# Altium schematic sheet pca20053_sheet3_nRF21540_FEM.SchDoc: Thingy:53 nRF21540 Front-end module
size A3; Organization: Nordic Semiconductor; DocumentNumber: 3; SheetNumber: 3; SheetTotal: 6; CompanyName: Nordic Semiconductor; DocumentSize: A3
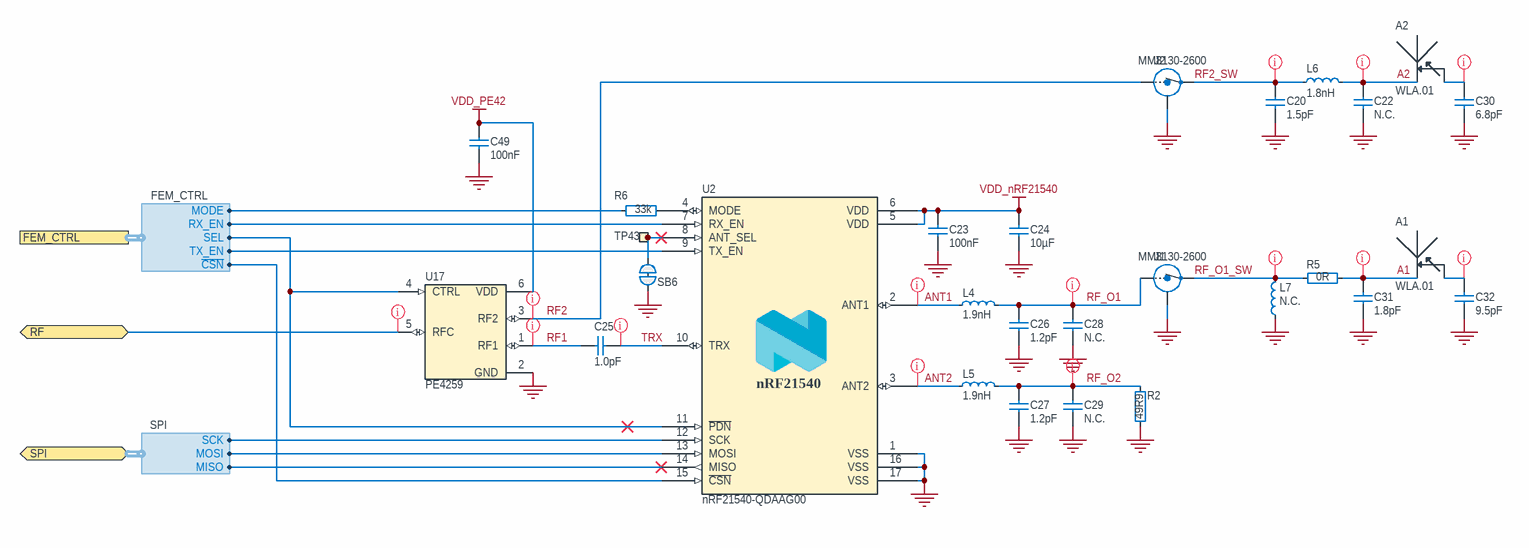
[diagram p0: pca20053_sheet3_nRF21540_FEM.SchDoc]

## Parts
A1  WLA.01  [WLA.01]
A2  WLA.01  [WLA.01]
C20  1.5pF  [CAPC0603X03L_C]
C22  N.C.  [CAPC0603X03L_C_NC]
C23  100nF  [CAPC0603X03L_C]
C24  10µF  [CAPC1608X06L]
C25  1.0pF  [CAPC0603X03L_C]
C26  1.2pF  [CAPC0603X03L_C]
C27  1.2pF  [CAPC0603X03L_C]
C28  N.C.  [CAPC0603X03L_C_NC]
C29  N.C.  [CAPC0603X03L_C_NC]
C30  6.8pF  [CAPC0603X03L_C]
C31  1.8pF  [CAPC0603X03L_C]
C32  9.5pF  [CAPC0603X03L_C]
C49  100nF  [CAPC0603X03L_C]
J1  MM8130-2600  [COAXIAL-SWF]
J2  MM8130-2600  [COAXIAL-SWF]
L4  1.9nH  [INDC0603X03L_C]
L5  1.9nH  [INDC0603X03L_C]
L6  1.8nH  [INDC0603X03L_C]
L7  N.C.  [INDC0603X03L_C_NC]
R2  49R9  [RESC1005X04L]
R5  0R  [RESC0603X03L_C]
R6  33k  [RESC0603X03L_C]
SB6  Solderbridge  [Solderbridge_Shorted]  (value not drawn)  (net tie, no BOM)
TP43  Ø1.5mm,SMD  [TP_SMD_D1.5mm]  (value not drawn)  (no BOM)
U2  nRF21540-QDAAG00  [QFN65P400X400X65_HS-17N]
U17  PE4259  [SOT65P210X100-6N]

## Ports
FEM_CTRL (harness FEM_CTRL), RF (bidir), SPI (bidir, harness SPI)

## Harnesses
SPI: MISO, MOSI, SCK
FEM_CTRL: MODE, RX_EN, SEL, TX_EN, ~{CSN}

## Nets
GND: A1.2(GND) A2.2(GND) C20.1 C22.1 C23.1 C24.1 C26.1 C27.1 C28.1 C29.1 C30.2 C31.1 C32.2 C49.1 J1.2(Shield) J2.2(Shield) L7.1 R2.1 SB6.2 U2.1(VSS) U2.16(VSS) U2.17(VSS) U17.2(GND)
VDD_nRF21540: C23.2 C24.2 U2.5(VDD) U2.6(VDD)
VDD_PE42: C49.2 U17.6(VDD)
A1: A1.1 C31.2 R5.2
A2: A2.1 C22.2 L6.2
ANT1: L4.1 U2.2(ANT1)
ANT2: L5.1 U2.3(ANT2)
RF: U17.5(RFC) ; port RF
RF1: C25.1 U17.1(RF1)
RF2: J2.1(IN) U17.3(RF2)
RF2_SW: C20.2 J2.3(OUT) L6.1
RF_O1: C26.2 C28.2 J1.1(IN) L4.2
RF_O1_SW: J1.3(OUT) L7.2 R5.1
RF_O2: C27.2 C29.2 L5.2 R2.2
TRX: C25.2 U2.10(TRX)
NetA1_3: A1.3(Tuning) C32.1
NetA2_3: A2.3(Tuning) C30.1
NetR6_1: R6.1 ; port FEM_CTRL.MODE
NetR6_2: R6.2 U2.4(MODE)
NetSB6_1: SB6.1 TP43.1 U2.8(ANT_SEL)
NetU2_7: U2.7(RX_EN) ; port FEM_CTRL.RX_EN
NetU2_9: U2.9(TX_EN) ; port FEM_CTRL.TX_EN
NetU2_11: U2.11(~{PDN}) U17.4(CTRL) ; port FEM_CTRL.SEL
NetU2_12: U2.12(SCK) ; port SPI.SCK
NetU2_13: U2.13(MOSI) ; port SPI.MOSI
NetU2_14: U2.14(MISO) ; port SPI.MISO
NetU2_15: U2.15(~{CSN}) ; port FEM_CTRL.~{CSN}

## Layout directives
net class RF: A1, A2, ANT1, ANT2, NetA1_3, NetA2_3, RF, RF1, RF2, RF2_SW, RF_O1, RF_O1_SW, RF_O2, TRX

## Notes on the sheet
- Title
- Size
- Date:
- File:
- A3
- PCB Assembly Number
- Sheet         of
- Drawn By:
- Revision
- Classification:
- (in symbol nRF21540-QDAAG0) nRF21540

## Library data of the parts
A1 A2 = WLA.01: 2.4GHz Ceramic SMD Loop Antenna; Manufacturer: Taoglas; Part number NEMS: 100700063; Note: N.A.; Pad Count: 3; Component Status: Active; Part Number: WLA.01; Manufacturer Part Number: WLA.01; ComponentLink1URL: https://cdn3.taoglas.com/datasheets/WLA.01.pdf; ComponentLink1Description: Datasheet; ComponentLink2URL: https://www.digikey.com/product-detail/en/taoglas-limited/WLA-01/931-1077-1-ND/2332742; ComponentLink2Description: Supplier link; HelpURL: https://www.taoglas.com/product/wla-01-2-42-5ghz-ceramic-loop-antenna-3-21-60-5mm-linear-polarized/; Footprint Doc: WLA.01; LatestRevisionDate: 2020-03-23; Published: 2020-03-23; Value: WLA.01; Supplier 1: Digi-Key; Supplier Part Number 1: 931-1077-1-ND; Supplier 2: N.A.; Supplier Part Number 2: N.A.; Artikkelnr Noca: N.A.; Part number IPS: N.A.; Component Class: Antennas; PartId: 100700063; Author: rsk; Part number Norautron: N.A.
C20 = C0201-1.5p-25V-NP0-GJM0335C1E1R5WB01: Capacitor, NP0, ±0.05pF, 25V, High Q; Manufacturer: Murata; Part number NEMS: 100200477; Pad Count: 2; Artikkelnr Noca: N.A.; Component Status: Active; Part Number: C0201-1.5p-25V-NP0-GJM0335C1E1R5WB01; PartId: 100200477; Component Class: Capacitors; Author: masi; Manufacturer Part Number: GJM0335C1E1R5WB01; ComponentLink1URL: https://search.murata.co.jp/Ceramy/image/img/A01X/G101/ENG/GJM0335C1E1R5WB01-01.pdf; ComponentLink1Description: Datasheet; ComponentLink2URL: N.A.; ComponentLink2Description: Supplier link; HelpURL: https://www.murata.com/products/productdetail?partno=GJM0335C1E1R5WB01%23; Footprint Doc: 0201; LatestRevisionDate: 2021-06-15; Published: 2021-06-15; Value: 1.5pF; Note: 25V; Supplier 1: Digi-Key; Supplier Part Number 1: 490-11176-2-ND; Supplier 2: Mouser; Supplier Part Number 2: 81-GJM0335C1E1R5WB1D; Part number IPS: N.A.; Part number Norautron: N.A.
C22 C28 C29 = C0201-N.C.: Not mounted; Manufacturer: N.A.; Part number NEMS: 100200001; Assembly: Not mounted; Note: Chip Cap; Pad Count: 2; Component Status: Active; Part Number: C0201-N.C.; Manufacturer Part Number: N.A.; ComponentLink1URL: N.A.; ComponentLink1Description: Datasheet; ComponentLink2URL: N.A.; ComponentLink2Description: Supplier link; HelpURL: N.A.; Footprint Doc: 0201; LatestRevisionDate: 2014-11-13; Published: 2014-11-13; Value: N.C.; Supplier 1: N.A.; Supplier Part Number 1: N.A.; Supplier 2: N.A.; Supplier Part Number 2: N.A.; Artikkelnr Noca: N.A.; Part number IPS: N.A.; Component Class: Capacitors; PartId: 100200001; Author: rsk; Part number Norautron: N.A.
C23 C49 = C0201-100n-6.3V-X5R: Capacitor, Ceramic, X5R, ±10%, 6.3V; Manufacturer: Murata; Manufacturer Part Number: GRM033R60J104KE19D; Part number NEMS: 100200451; Artikkelnr Noca: N.A.; Pad Count: 2; Component Status: Active; Part Number: C0201-100n-6.3V-X5R; ComponentLink1URL: https://search.murata.co.jp/Ceramy/image/img/A01X/G101/ENG/GRM033R60J104KE19-01.pdf; ComponentLink1Description: Datasheet; ComponentLink2URL: https://www.murata.com/en-eu/products/productdetail?partno=GRM033R60J104KE19%23; ComponentLink2Description: Supplier link; HelpURL: N.A.; Footprint Doc: 0201; LatestRevisionDate: 2020-12-15; Published: 2020-12-15; Value: 100nF; Note: 6.3V; Part number IPS: N.A.; Supplier 1: Digi-Key; Supplier Part Number 1: 490-3167-1-ND; Supplier 2: N.A.; Supplier Part Number 2: N.A.; Component Class: Capacitors; PartId: 100200451; Author: rsk; Part number Norautron: N.A.
C24 = C0603-10µ-25V-X5R-GRM188R61E106MA73J: Capacitor, Ceramic, X5R, ±20%, 25V; Manufacturer: Murata; Part number NEMS: 100200456; Artikkelnr Noca: N.A.; Pad Count: 2; Component Status: Active; Part Number: C0603-10µ-25V-X5R-GRM188R61E106MA73J; Manufacturer Part Number: GRM188R61E106MA73J; ComponentLink1URL: https://search.murata.co.jp/Ceramy/image/img/A01X/G101/ENG/GRM188R61E106MA73-01.pdf; ComponentLink1Description: Datasheet; ComponentLink2URL: https://www.murata.com/en-global/products/productdetail?partno=GRM188R61E106MA73%23; ComponentLink2Description: Supplier link; HelpURL: N.A.; Footprint Doc: 0603; LatestRevisionDate: 2021-07-22; Published: 2020-12-16; Value: 10µF; Note: 25V; Part number IPS: N.A.; Supplier 1: Digi-Key; Supplier Part Number 1: 490-12737-1-ND; Supplier 2: Mouser; Supplier Part Number 2: 81-GRM188R61E106MA3J; Component Class: Capacitors; PartId: 100200456; Author: rsk; Part number Norautron: N.A.
C25 = C0201-1p0: Capacitor, C0G, ±0.1pF, 25V; Manufacturer: Murata; Manufacturer Part Number: GJM0335C1E1R0BB01D; Part number IPS: 00000007964; Part number NEMS: 100200398; Artikkelnr Noca: N.A.; Pad Count: 2; Component Status: Active; Part Number: C0201-1p0; ComponentLink1URL: N.A.; ComponentLink1Description: Datasheet; ComponentLink2Description: Supplier link; HelpURL: http://search.murata.co.jp/Ceramy/image/img/A01X/G101/ENG/GJM0335C1E1R0BB01-01.pdf; Footprint Doc: 0201; LatestRevisionDate: 2020-10-13; Published: 2017-09-21; Value: 1.0pF; Note: ±0.1pF; ComponentLink2URL: N.A.; Supplier 1: Digi-Key; Supplier Part Number 1: 490-11172-1-ND; Supplier 2: N.A.; Supplier Part Number 2: N.A.; Component Class: Capacitors; PartId: 100200398; Author: rsk; Part number Norautron: N.A.
C26 C27 = C0201-1.2p-HQ-Murata: Capacitor, NP0, ±0.05pF, 50V; Manufacturer: Murata; Manufacturer Part Number: GJM0335C1H1R2WB01D; Part number NEMS: 100200457; Artikkelnr Noca: N.A.; Pad Count: 2; Component Status: Active; Part Number: C0201-1.2p-HQ-Murata; ComponentLink1URL: https://search.murata.co.jp/Ceramy/image/img/A01X/G101/ENG/GJM0335C1H1R2WB01-01.pdf; ComponentLink1Description: Datasheet; ComponentLink2URL: https://www.murata.com/en-global/products/productdetail?partno=GJM0335C1H1R2WB01%23; ComponentLink2Description: Supplier link; HelpURL: N.A.; Footprint Doc: 0201; LatestRevisionDate: 2020-12-16; Published: 2020-12-16; Value: 1.2pF; Note: 50V; Part number IPS: N.A.; Supplier 1: Digi-Key; Supplier Part Number 1: 490-GJM0335C1H1R2WB01DCT-ND; Supplier 2: Mouser; Supplier Part Number 2: 81-GJM0335C1H1R2WB1D; Component Class: Capacitors; PartId: 100200457; Author: rsk; Part number Norautron: N.A.
C30 = C0201-6.8p-HQ-Murata: Capacitor, NP0, ±0.1pF, 25V; Manufacturer: Murata; Manufacturer Part Number: GJM0335C1E6R8BB01; Part number NEMS: 100200463; Artikkelnr Noca: N.A.; Pad Count: 2; Component Status: Active; Part Number: C0201-6.8p-HQ-Murata; ComponentLink1URL: N.A.; ComponentLink1Description: Datasheet; ComponentLink2URL: N.A.; ComponentLink2Description: Supplier link; HelpURL: https://psearch.en.murata.com/capacitor/product/GJM0335C1E6R8BB01%23.html; Footprint Doc: 0201; LatestRevisionDate: 2021-02-16; Published: 2021-02-16; Value: 6.8pF; Note: 25V; Supplier 1: Digi-Key; Supplier Part Number 1: 490-11183-1-ND; Supplier 2: N.A.; Supplier Part Number 2: N.A.; Part number IPS: N.A.; Component Class: Capacitors; Author: rubr; PartId: 100200463; Part number Norautron: N.A.
C31 = C0201-1.8p-HQ-Murata: Capacitor, NP0, ±0.1pF, 25V; Manufacturer: Murata; Manufacturer Part Number: GJM0335C1E1R8BB01; Part number NEMS: 100200461; Artikkelnr Noca: N.A.; Pad Count: 2; Component Status: Active; Part Number: C0201-1.8p-HQ-Murata; ComponentLink1URL: N.A.; ComponentLink1Description: Datasheet; ComponentLink2URL: N.A.; ComponentLink2Description: Supplier link; HelpURL: https://psearch.en.murata.com/capacitor/product/GJM0335C1E1R8BB01%23.html; Footprint Doc: 0201; LatestRevisionDate: 2021-02-16; Published: 2021-02-16; Value: 1.8pF; Note: 25V; Supplier 1: Digi-Key; Supplier Part Number 1: 490-8581-1-ND; Supplier 2: N.A.; Supplier Part Number 2: N.A.; Part number IPS: N.A.; Component Class: Capacitors; Author: rubr; PartId: 100200461; Part number Norautron: N.A.
C32 = C0201-9.5p-50V-NP0-GJM0335C1H9R5WB01: Capacitor, NP0, ±0.05pF, 50V, High Q; Manufacturer: Murata; Part number NEMS: 100200476; Artikkelnr Noca: N.A.; Pad Count: 2; Component Status: Active; Part Number: C0201-9.5p-50V-NP0-GJM0335C1H9R5WB01; Manufacturer Part Number: GJM0335C1H9R5WB01; ComponentLink1URL: https://no.mouser.com/datasheet/2/281/GJM0335C1H9R5WB01_01-1971631.pdf; ComponentLink1Description: Datasheet; ComponentLink2URL: N.A.; ComponentLink2Description: Supplier link; HelpURL: https://www.murata.com/en-eu/products/productdetail?partno=GJM0335C1H9R5WB01%23; Footprint Doc: 0201; LatestRevisionDate: 2021-06-11; Published: 2021-06-11; Value: 9.5pF; Note: 50V; Supplier 1: N.A.; Supplier Part Number 1: N.A.; Supplier 2: Mouser; Supplier Part Number 2: 81-GJM0335C1H9R5WB1D; Part number IPS: N.A.; Component Class: Capacitors; Author: masi; Part number Norautron: N.A.; PartId: 100200476
J1 J2 = MM8130-2600: Coaxial Connector with Switch; Manufacturer: Murata; Part number IPS: 00000009955; Part number Norautron: 26030338; Part number NEMS: 100500400; Note: N.A.; Artikkelnr Noca: 55029011; Pad Count: 3; Component Status: Active; Part Number: MM8130-2600; Manufacturer Part Number: MM8130-2600; LatestRevisionDate: 2014-04-24; Published: 2014-04-24; Value: MM8130-2600; Footprint Doc: COAXIAL-SWF; ComponentLink1URL: N.A.; ComponentLink1Description: Datasheet; ComponentLink2URL: N.A.; ComponentLink2Description: Supplier link; HelpURL: http://www.murata.com/products/catalog/pdf/o33e.pdf; Supplier 1: Digi-Key; Supplier Part Number 1: 490-4981-1-ND; Supplier 2: Mouser; Supplier Part Number 2: 81-MM8130-2600RA2; Component Class: Connectors; PartId: 100500400; Author: rsk; System: Connector
L4 L5 = L0201-1n9-HQ-Murata: Inductor, 600mA, ±0.1ｎH, 120mOhm; Manufacturer: Murata; Manufacturer Part Number: LQP03HQ1N9B02; Part number IPS: 00000004903; Part number NEMS: 100300206; Note: -55°C ~ 125°C; Artikkelnr Noca: N.A.; Pad Count: 2; Component Status: Active; Part Number: L0201-1n9-HQ-Murata; ComponentLink1URL: https://search.murata.co.jp/Ceramy/image/img/P02/JELF243C-0021.pdf; ComponentLink1Description: Datasheet; ComponentLink2Description: Supplier link; HelpURL: https://psearch.en.murata.com/inductor/product/LQP03HQ1N9B02%23.html; Footprint Doc: 0201; LatestRevisionDate: 2018-10-23; Published: 2018-10-23; Value: 1.9nH; ComponentLink2URL: N.A.; Supplier 1: Digi-Key; Supplier Part Number 1: 490-13889-1-ND; Supplier 2: N.A.; Supplier Part Number 2: N.A.; Component Class: Inductors; PartId: 100300206; Author: rsk; Part number Norautron: N.A.
L6 = L0201-1n8-HQ-Murata: Inductor, 800mA, ±0.1ｎH, 80mOhm; Manufacturer: Murata; Manufacturer Part Number: LQP03HQ1N8B02; Part number NEMS: 100300205; Note: -55°C ~ 125°C; Artikkelnr Noca: N.A.; Pad Count: 2; Component Status: Active; Part Number: L0201-1n8-HQ-Murata; ComponentLink1URL: https://search.murata.co.jp/Ceramy/image/img/P02/JELF243C-0021.pdf; ComponentLink1Description: Datasheet; ComponentLink2URL: N.A.; ComponentLink2Description: Supplier link; HelpURL: https://psearch.en.murata.com/inductor/product/LQP03HQ1N8B02%23.html; Footprint Doc: 0201; LatestRevisionDate: 2018-10-23; Published: 2018-10-23; Value: 1.8nH; Supplier 1: Digi-Key; Supplier Part Number 1: 490-13887-1-ND; Supplier 2: N.A.; Supplier Part Number 2: N.A.; Part number IPS: N.A.; Component Class: Inductors; PartId: 100300205; Author: rsk; Part number Norautron: N.A.
L7 = L0201-N.C.: Not mounted; Manufacturer: N.A.; Part number NEMS: 100300001; Assembly: Not mounted; Pad Count: 2; Component Status: Active; Part Number: L0201-N.C.; Manufacturer Part Number: N.A.; ComponentLink1URL: N.A.; ComponentLink1Description: Datasheet; ComponentLink2URL: N.A.; ComponentLink2Description: Supplier link; HelpURL: N.A.; Footprint Doc: 0201; LatestRevisionDate: 2013-04-10; Published: 2013-04-10; Value: N.C.; Note: N.A.; Supplier 1: N.A.; Supplier Part Number 1: N.A.; Supplier 2: N.A.; Supplier Part Number 2: N.A.; Artikkelnr Noca: N.A.; Part number IPS: N.A.; Component Class: Inductors; PartId: 100300001; Author: rsk; Part number Norautron: N.A.
R2 = R0402-49R9_0.1%: Resistor, ±1%, 0.063W; Manufacturer: Panasonic; Manufacturer Part Number: ERA-2AEB49R9X; Part number NEMS: 100100141; Pad Count: 2; Note: Chip Res 1%; Artikkelnr Noca: N.A.; Component Status: Active; Part Number: R0402-49R9_0.1%; PartId: 100100141; Component Class: Resistors; Author: rsk; ComponentLink1URL: N.A.; ComponentLink1Description: Datasheet; ComponentLink2URL: N.A.; ComponentLink2Description: Supplier link; HelpURL: N.A.; Footprint Doc: 0402; LatestRevisionDate: 2017-08-15; Published: 2017-08-15; Value: 49R9; Supplier 1: Digi-Key; Supplier Part Number 1: P49.9DCCT-ND; Supplier 2: N.A.; Supplier Part Number 2: N.A.; Part number IPS: N.A.; Part number Norautron: N.A.
R5 = R0201-0R: Resistor, ±5%, 0.05W; Manufacturer: N.A.; Part number IPS: 00000003245; Part number NEMS: 100100001; Note: Chip Res 5%; Pad Count: 2; Component Status: Active; Part Number: R0201-0R; Manufacturer Part Number: N.A.; ComponentLink1URL: N.A.; ComponentLink1Description: Datasheet; ComponentLink2URL: N.A.; ComponentLink2Description: Supplier link; HelpURL: N.A.; Footprint Doc: 0201; LatestRevisionDate: 2017-11-09; Published: 2014-11-13; Value: 0R; Supplier 1: N.A.; Supplier Part Number 1: N.A.; Supplier 2: N.A.; Supplier Part Number 2: N.A.; Artikkelnr Noca: N.A.; Component Class: Resistors; PartId: 100100001; Author: rsk; Part number Norautron: N.A.
R6 = R0201-33k: Resistor, ±1%, 0.05W; Manufacturer: N.A.; Part number IPS: 00000001708; Part number NEMS: 100100073; Pad Count: 2; Note: Chip Res 1%; Component Status: Active; Part Number: R0201-33k; PartId: 100100073; Component Class: Resistors; Author: rsk; Manufacturer Part Number: N.A.; ComponentLink1URL: N.A.; ComponentLink1Description: Datasheet; ComponentLink2URL: N.A.; ComponentLink2Description: Supplier link; HelpURL: N.A.; Footprint Doc: 0201; LatestRevisionDate: 2014-11-13; Published: 2014-11-13; Value: 33k; Supplier 1: N.A.; Supplier Part Number 1: N.A.; Supplier 2: N.A.; Supplier Part Number 2: N.A.; Artikkelnr Noca: N.A.; Part number Norautron: N.A.
SB6 = Solderbridge Shorted: Shorted Solderbridge; Manufacturer: N.A.; Part number NEMS: 100500459; Pad Count: 2; Component Status: Active; System: Connector; Part Number: Solderbridge Shorted; PartId: 100500459; Component Class: Connectors; Manufacturer Part Number: N.A.; ComponentLink1URL: N.A.; ComponentLink1Description: Datasheet; ComponentLink2URL: N.A.; ComponentLink2Description: Supplier link; HelpURL: N.A.; Footprint Doc: Solderbridge_Shorted; LatestRevisionDate: 2012-08-07; Published: 2012-08-07; Value: Solderbridge; Note: N.A.; Supplier 1: N.A.; Supplier Part Number 1: N.A.; Supplier 2: N.A.; Supplier Part Number 2: N.A.; Artikkelnr Noca: N.A.; Part number IPS: N.A.; Author: rsk; Part number Norautron: N.A.
TP43 = TP_SMD_Ø1.5MM: 1.5mm circular SMD testpad; Manufacturer: Nordic Semiconductor; Manufacturer Part Number: N.A.; Part number NEMS: 100500477; Pad Count: 1; Component Status: Active; System: Connector; Part Number: TP_SMD_Ø1.5MM; PartId: 100500477; Component Class: Connectors; ComponentLink1URL: N.A.; ComponentLink1Description: Datasheet; ComponentLink2URL: N.A.; ComponentLink2Description: Supplier link; HelpURL: N.A.; Footprint Doc: TP_SMD_Ø1.5mm; LatestRevisionDate: 2021-03-05; Published: 2016-06-02; Value: Ø1.5mm,SMD; Note: N.A.; Supplier 1: N.A.; Supplier Part Number 1: N.A.; Supplier 2: N.A.; Supplier Part Number 2: N.A.; Artikkelnr Noca: N.A.; Part number IPS: N.A.; Author: rsk; Part number Norautron: N.A.
U2 = nRF21540-QDAAG0: Radio front-end / range extender for 2.4GHz; Manufacturer: Nordic Semiconductor; Part number NEMS: 102000223; Pad Count: 16; Note: N.A.; Component Status: Active; Part Number: nRF21540-QDAAG0; Component Class: nRF_Devices; Manufacturer Part Number: nRF21540-QDAAG00; ComponentLink1URL: N.A.; ComponentLink1Description: Datasheet; ComponentLink2URL: N.A.; ComponentLink2Description: Supplier link; HelpURL: N.A.; Footprint Doc: QFN-16; LatestRevisionDate: 2021-03-24; Published: 2021-03-24; Value: nRF21540-QDAAG00; Supplier 1: Nordic Semiconductor; Supplier Part Number 1: nRF21540-QDAAG00; Supplier 2: N.A.; Supplier Part Number 2: N.A.; Artikkelnr Noca: N.A.; Part number IPS: N.A.; Author: hany; Part number Norautron: N.A.; PartId: 102000223
U17 = PE4259G-06SC70: SPDT High Power UltraCMOS® 10 MHz–3.0 GHz RF Switch; Manufacturer: pSemi; Manufacturer Part Number: 4259-63; Part number NEMS: 101900641; Pad Count: 6; Note: N.A.; Component Status: Active; Part Number: PE4259G-06SC70; Component Class: Misc_ICs; ComponentLink1URL: https://www.psemi.com/pdf/datasheets/pe4259ds.pdf; ComponentLink1Description: Datasheet; ComponentLink2URL: https://www.digikey.com/en/products/detail/psemi/4259-63/2614473; ComponentLink2Description: Supplier link; HelpURL: N.A.; Footprint Doc: SC70-6; LatestRevisionDate: 2021-01-08; Published: 2021-01-08; Value: PE4259; Supplier 1: Digi-Key; Supplier Part Number 1: 1046-1011-1-ND; Supplier 2: N.A.; Supplier Part Number 2: N.A.; Artikkelnr Noca: N.A.; Part number IPS: N.A.; PartId: 101900641; Author: rsk; Part number Norautron: N.A.